# EAGLE schematic Matrix (EAGLE 6.5.0)

## Sheet 1 of 2
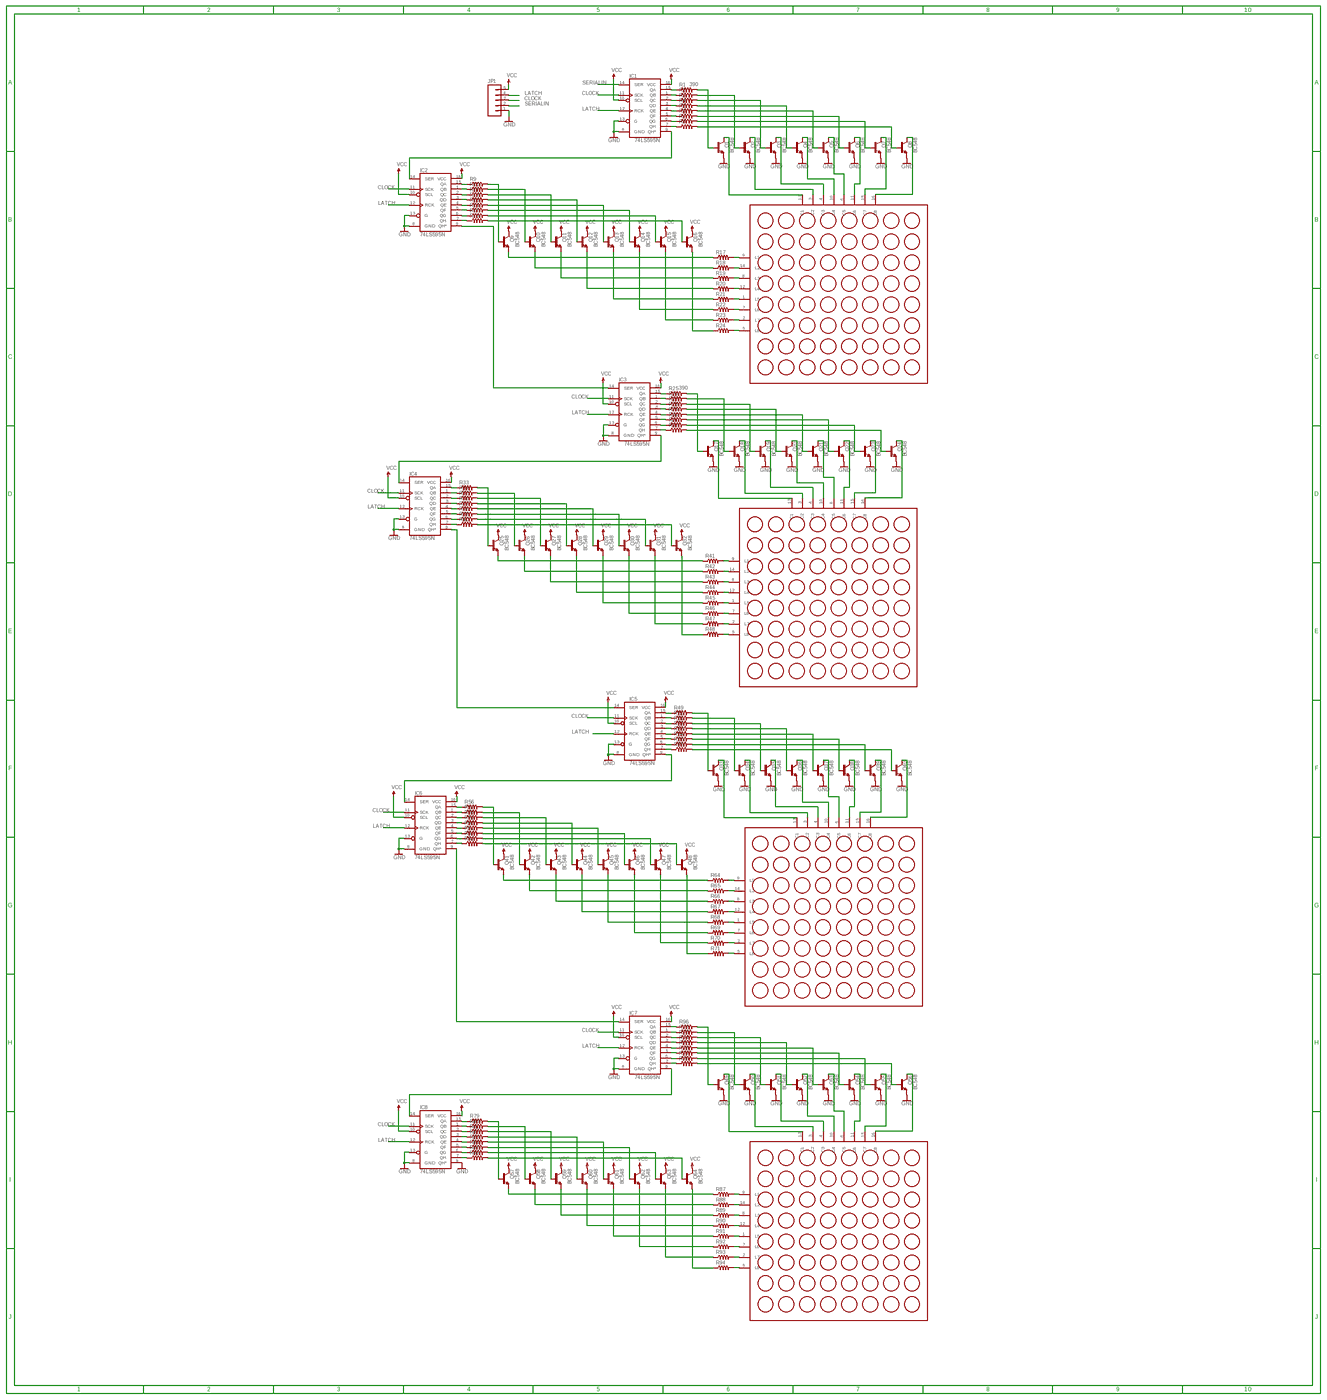
[diagram p0: schematic, sheet 1, overview]
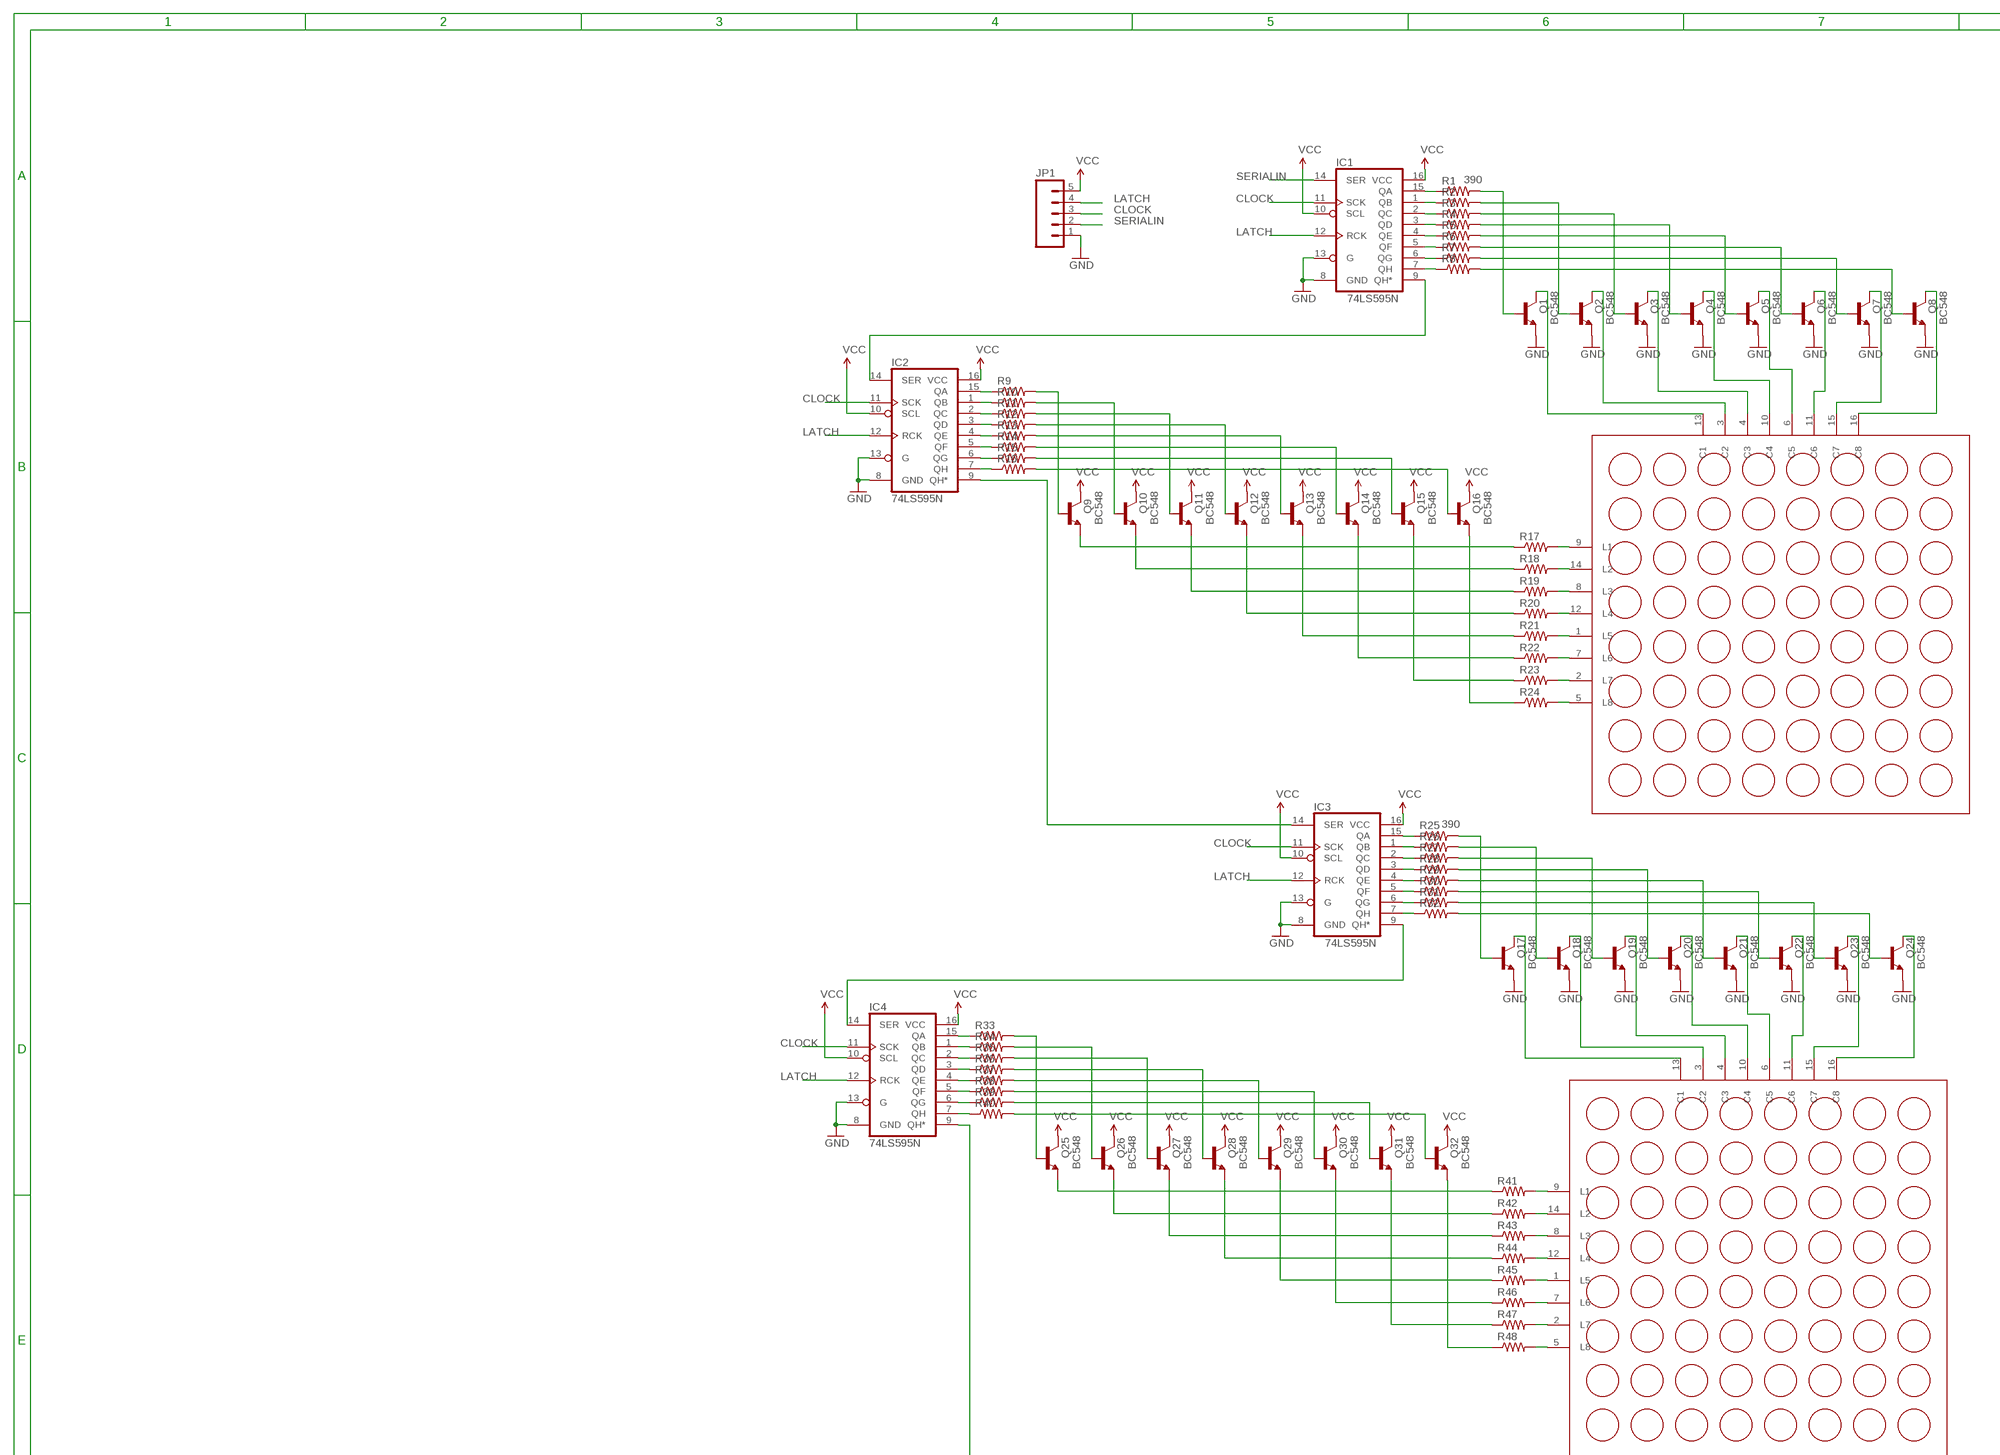
[diagram p1: schematic, sheet 1, part 1 of 4]
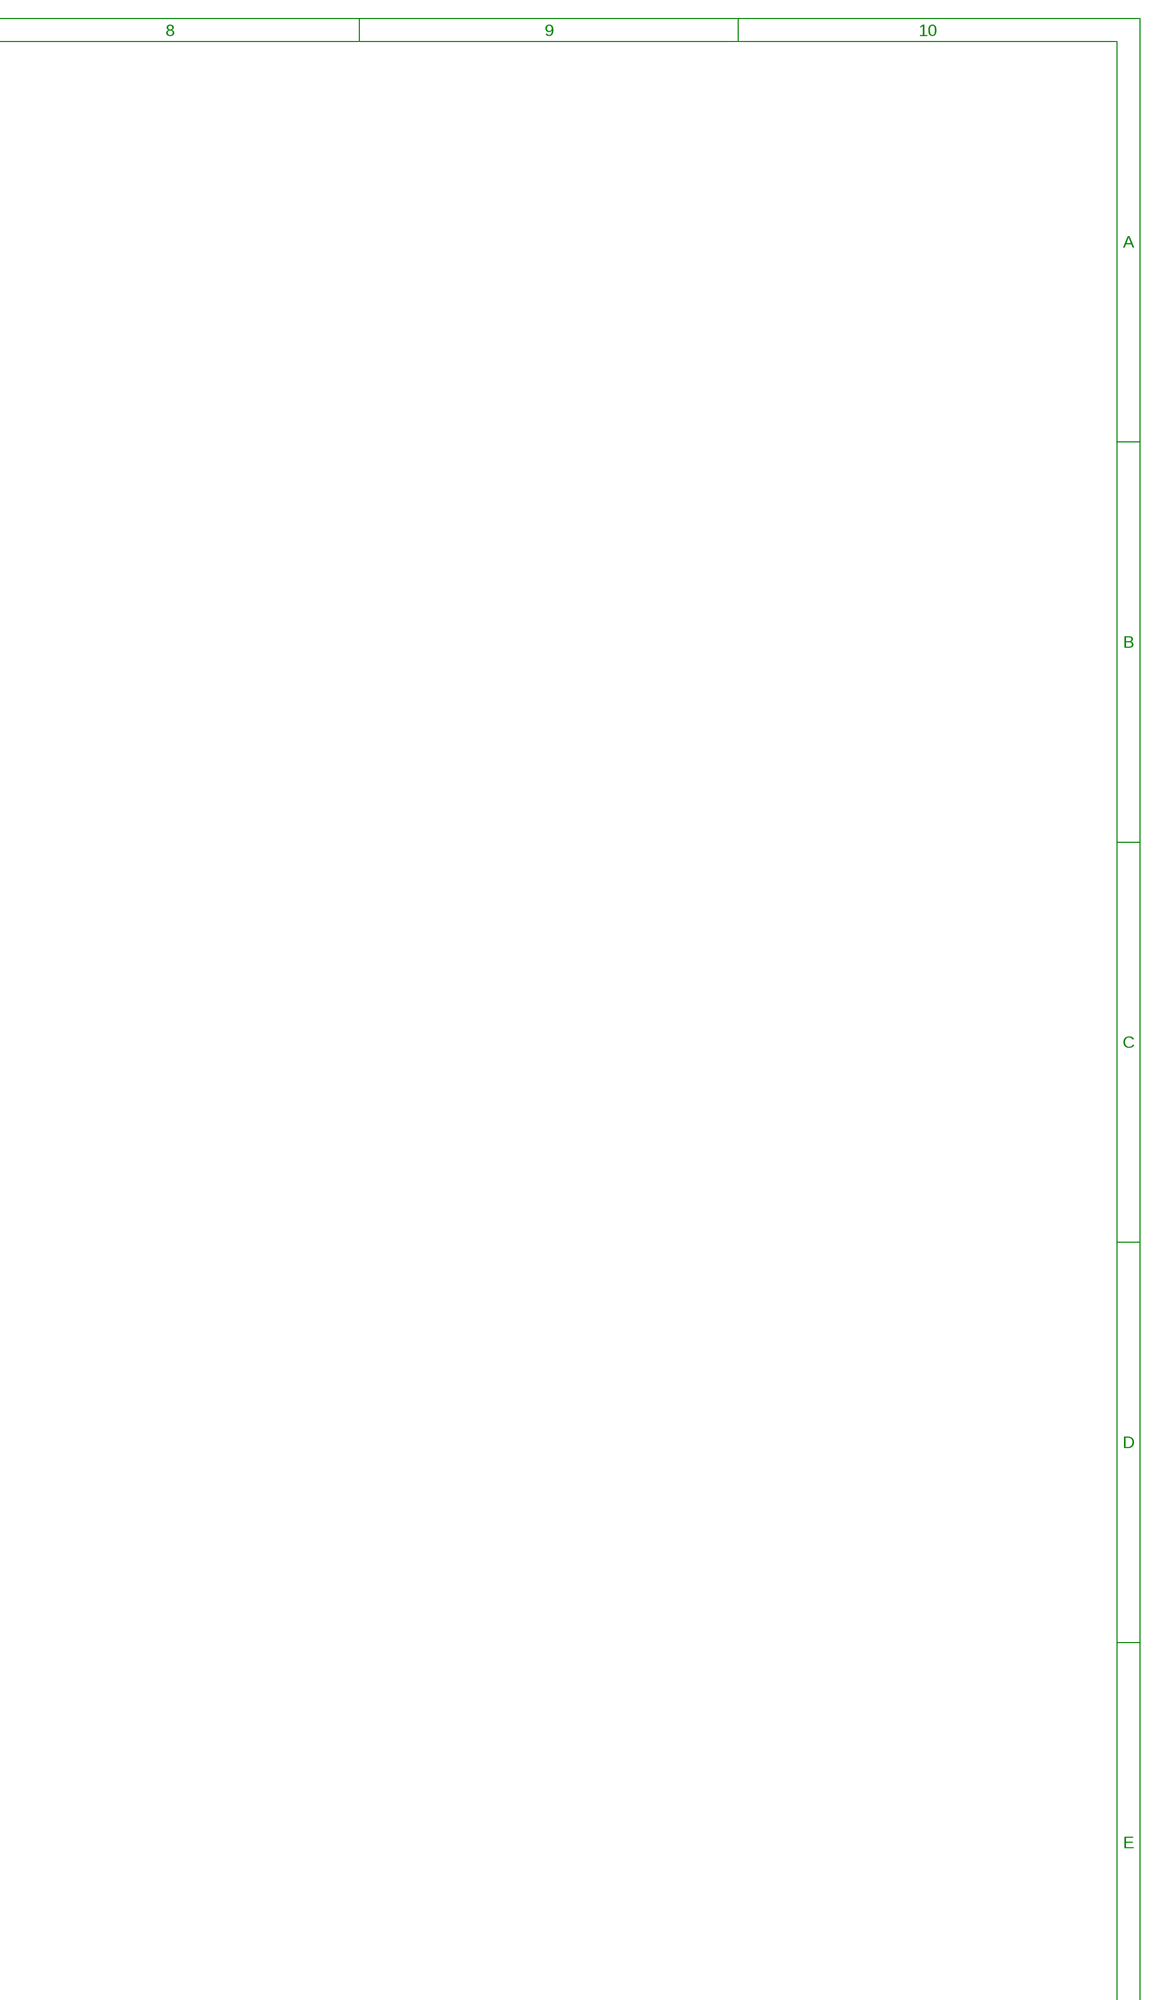
[diagram p2: schematic, sheet 1, part 2 of 4]
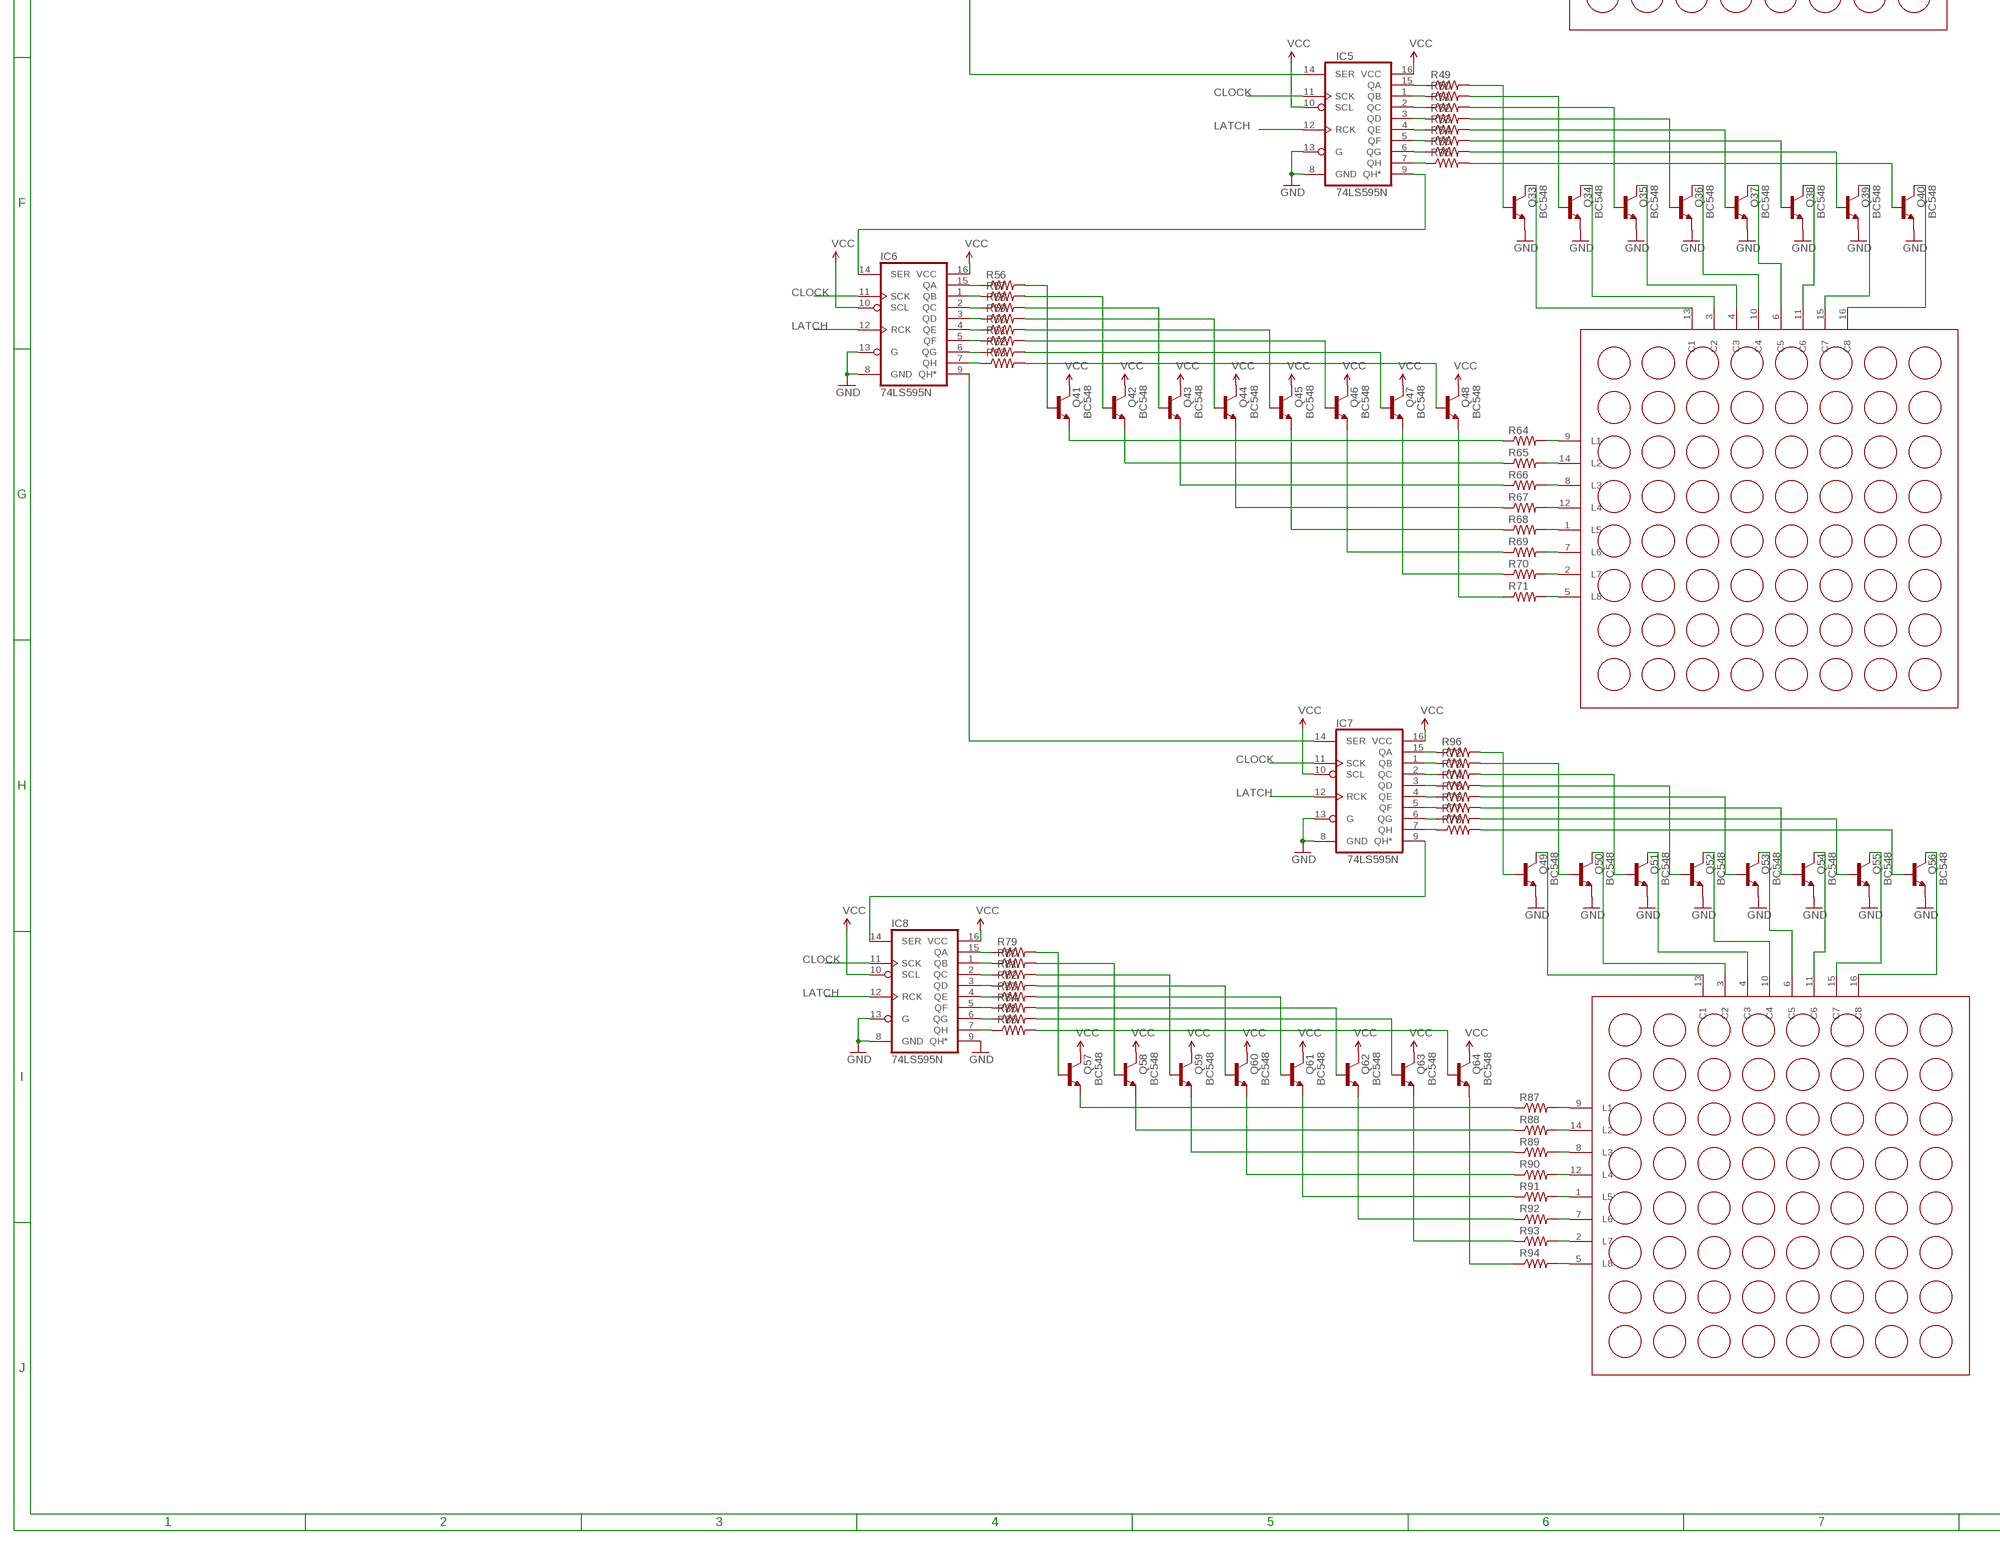
[diagram p3: schematic, sheet 1, part 3 of 4]
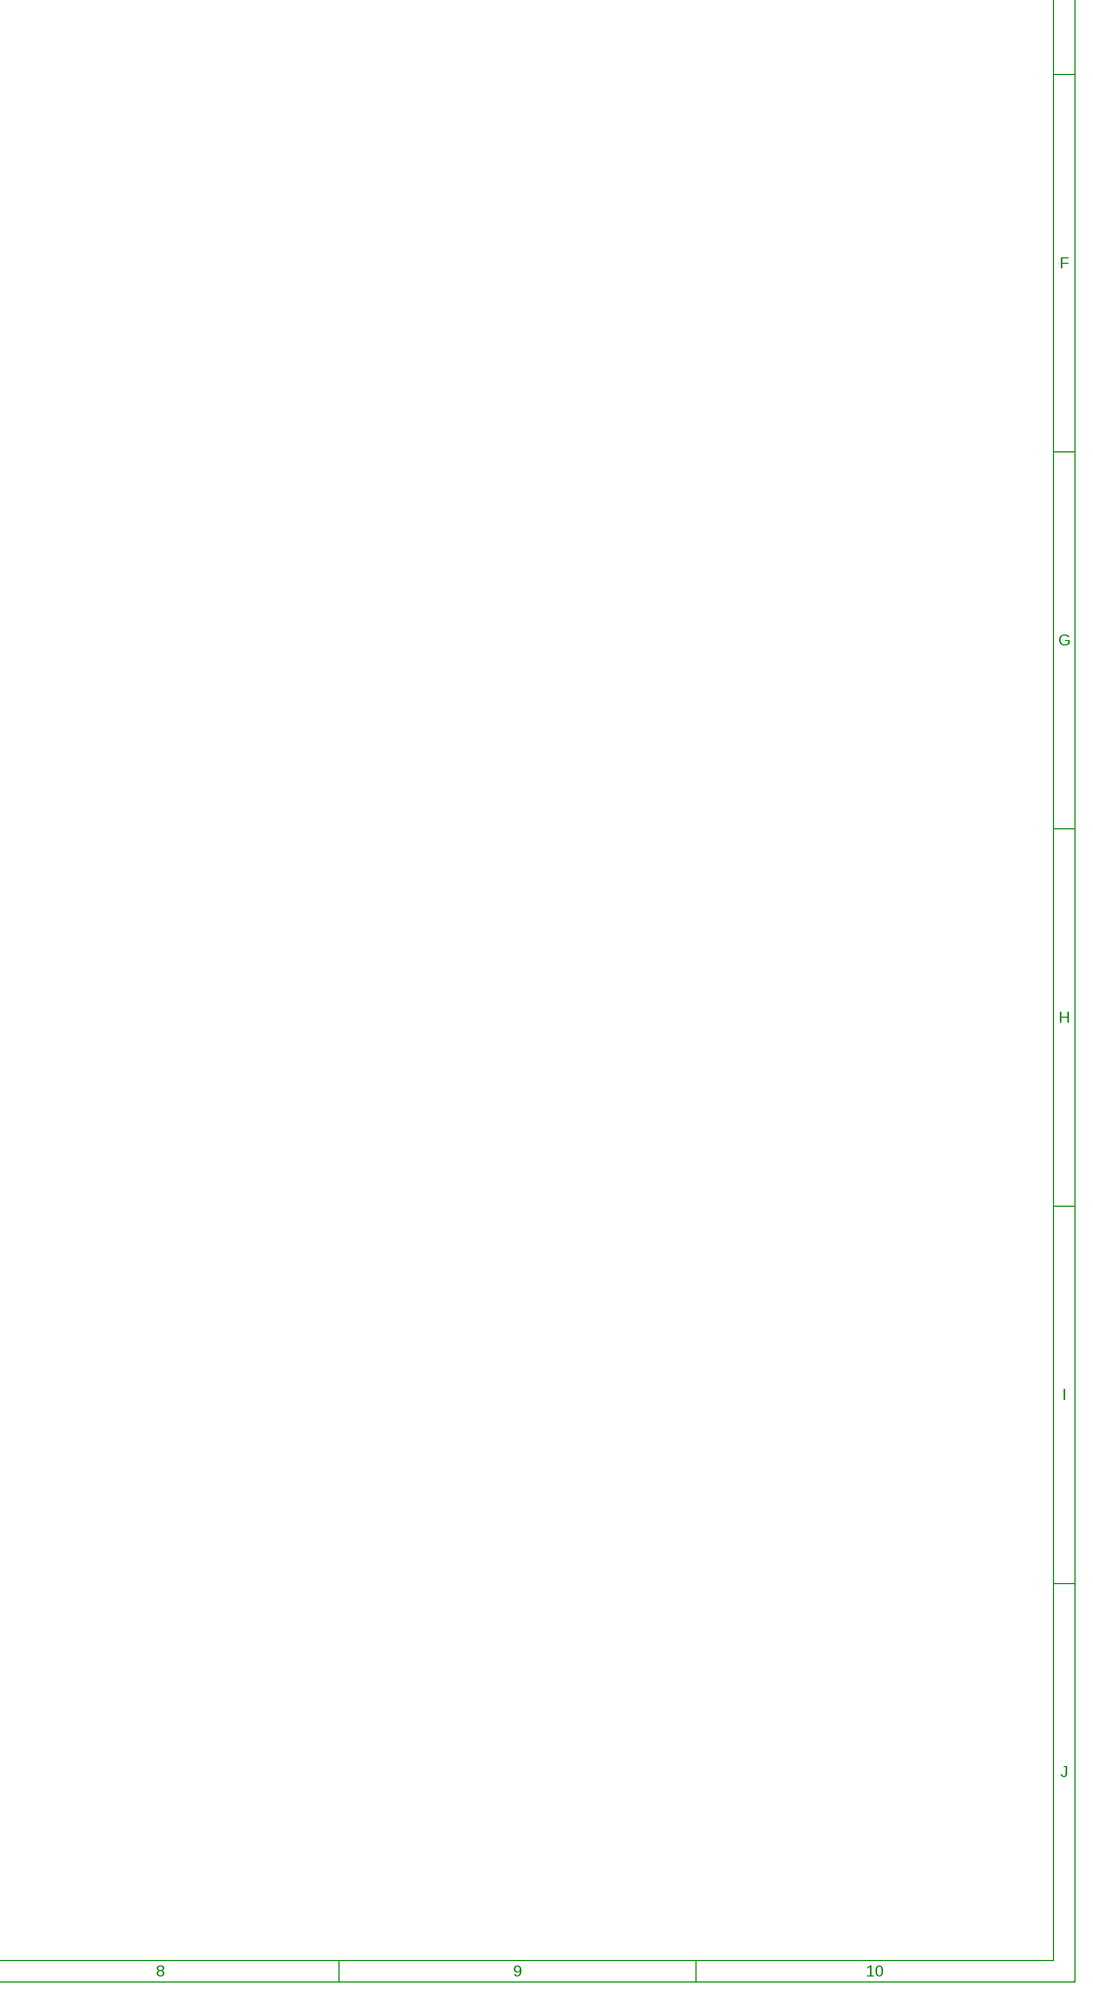
[diagram p4: schematic, sheet 1, part 4 of 4]

### Parts
IC1  74LS595N  [DIL16]
IC2  74LS595N  [DIL16]
IC3  74LS595N  [DIL16]
IC4  74LS595N  [DIL16]
IC5  74LS595N  [DIL16]
IC6  74LS595N  [DIL16]
IC7  74LS595N  [DIL16]
IC8  74LS595N  [DIL16]
JP1  M05PTH_LONGPADS  [1X05_LONGPADS]
Q1  BC548  [TO92-EBC]
Q2  BC548  [TO92-EBC]
Q3  BC548  [TO92-EBC]
Q4  BC548  [TO92-EBC]
Q5  BC548  [TO92-EBC]
Q6  BC548  [TO92-EBC]
Q7  BC548  [TO92-EBC]
Q8  BC548  [TO92-EBC]
Q9  BC548  [TO92-EBC]
Q10  BC548  [TO92-EBC]
Q11  BC548  [TO92-EBC]
Q12  BC548  [TO92-EBC]
Q13  BC548  [TO92-EBC]
Q14  BC548  [TO92-EBC]
Q15  BC548  [TO92-EBC]
Q16  BC548  [TO92-EBC]
Q17  BC548  [TO92-EBC]
Q18  BC548  [TO92-EBC]
Q19  BC548  [TO92-EBC]
Q20  BC548  [TO92-EBC]
Q21  BC548  [TO92-EBC]
Q22  BC548  [TO92-EBC]
Q23  BC548  [TO92-EBC]
Q24  BC548  [TO92-EBC]
Q25  BC548  [TO92-EBC]
Q26  BC548  [TO92-EBC]
Q27  BC548  [TO92-EBC]
Q28  BC548  [TO92-EBC]
Q29  BC548  [TO92-EBC]
Q30  BC548  [TO92-EBC]
Q31  BC548  [TO92-EBC]
Q32  BC548  [TO92-EBC]
Q33  BC548  [TO92-EBC]
Q34  BC548  [TO92-EBC]
Q35  BC548  [TO92-EBC]
Q36  BC548  [TO92-EBC]
Q37  BC548  [TO92-EBC]
Q38  BC548  [TO92-EBC]
Q39  BC548  [TO92-EBC]
Q40  BC548  [TO92-EBC]
Q41  BC548  [TO92-EBC]
Q42  BC548  [TO92-EBC]
Q43  BC548  [TO92-EBC]
Q44  BC548  [TO92-EBC]
Q45  BC548  [TO92-EBC]
Q46  BC548  [TO92-EBC]
Q47  BC548  [TO92-EBC]
Q48  BC548  [TO92-EBC]
Q49  BC548  [TO92-EBC]
Q50  BC548  [TO92-EBC]
Q51  BC548  [TO92-EBC]
Q52  BC548  [TO92-EBC]
Q53  BC548  [TO92-EBC]
Q54  BC548  [TO92-EBC]
Q55  BC548  [TO92-EBC]
Q56  BC548  [TO92-EBC]
Q57  BC548  [TO92-EBC]
Q58  BC548  [TO92-EBC]
Q59  BC548  [TO92-EBC]
Q60  BC548  [TO92-EBC]
Q61  BC548  [TO92-EBC]
Q62  BC548  [TO92-EBC]
Q63  BC548  [TO92-EBC]
Q64  BC548  [TO92-EBC]
R1  390  RESISTORPTH-1/4W  [AXIAL-0.4]
R2  390  RESISTORPTH-1/4W  [AXIAL-0.4]
R3  390  RESISTORPTH-1/4W  [AXIAL-0.4]
R4  390  RESISTORPTH-1/4W  [AXIAL-0.4]
R5  390  RESISTORPTH-1/4W  [AXIAL-0.4]
R6  390  RESISTORPTH-1/4W  [AXIAL-0.4]
R7  390  RESISTORPTH-1/4W  [AXIAL-0.4]
R8  390  RESISTORPTH-1/4W  [AXIAL-0.4]
R9  390  RESISTORPTH-1/4W  [AXIAL-0.4]
R10  390  RESISTORPTH-1/4W  [AXIAL-0.4]
R11  390  RESISTORPTH-1/4W  [AXIAL-0.4]
R12  390  RESISTORPTH-1/4W  [AXIAL-0.4]
R13  390  RESISTORPTH-1/4W  [AXIAL-0.4]
R14  390  RESISTORPTH-1/4W  [AXIAL-0.4]
R15  390  RESISTORPTH-1/4W  [AXIAL-0.4]
R16  390  RESISTORPTH-1/4W  [AXIAL-0.4]
R17  390  RESISTORPTH-1/4W  [AXIAL-0.4]
R18  390  RESISTORPTH-1/4W  [AXIAL-0.4]
R19  390  RESISTORPTH-1/4W  [AXIAL-0.4]
R20  390  RESISTORPTH-1/4W  [AXIAL-0.4]
R21  390  RESISTORPTH-1/4W  [AXIAL-0.4]
R22  390  RESISTORPTH-1/4W  [AXIAL-0.4]
R23  390  RESISTORPTH-1/4W  [AXIAL-0.4]
R24  390  RESISTORPTH-1/4W  [AXIAL-0.4]
R25  390  RESISTORPTH-1/4W  [AXIAL-0.4]
R26  390  RESISTORPTH-1/4W  [AXIAL-0.4]
R27  390  RESISTORPTH-1/4W  [AXIAL-0.4]
R28  390  RESISTORPTH-1/4W  [AXIAL-0.4]
R29  390  RESISTORPTH-1/4W  [AXIAL-0.4]
R30  390  RESISTORPTH-1/4W  [AXIAL-0.4]
R31  390  RESISTORPTH-1/4W  [AXIAL-0.4]
R32  390  RESISTORPTH-1/4W  [AXIAL-0.4]
R33  390  RESISTORPTH-1/4W  [AXIAL-0.4]
R34  390  RESISTORPTH-1/4W  [AXIAL-0.4]
R35  390  RESISTORPTH-1/4W  [AXIAL-0.4]
R36  390  RESISTORPTH-1/4W  [AXIAL-0.4]
R37  390  RESISTORPTH-1/4W  [AXIAL-0.4]
R38  390  RESISTORPTH-1/4W  [AXIAL-0.4]
R39  390  RESISTORPTH-1/4W  [AXIAL-0.4]
R40  390  RESISTORPTH-1/4W  [AXIAL-0.4]
R41  390  RESISTORPTH-1/4W  [AXIAL-0.4]
R42  390  RESISTORPTH-1/4W  [AXIAL-0.4]
R43  390  RESISTORPTH-1/4W  [AXIAL-0.4]
R44  390  RESISTORPTH-1/4W  [AXIAL-0.4]
R45  390  RESISTORPTH-1/4W  [AXIAL-0.4]
R46  390  RESISTORPTH-1/4W  [AXIAL-0.4]
R47  390  RESISTORPTH-1/4W  [AXIAL-0.4]
R48  390  RESISTORPTH-1/4W  [AXIAL-0.4]
R49  390  RESISTORPTH-1/4W  [AXIAL-0.4]
R50  390  RESISTORPTH-1/4W  [AXIAL-0.4]
R51  390  RESISTORPTH-1/4W  [AXIAL-0.4]
R52  390  RESISTORPTH-1/4W  [AXIAL-0.4]
R53  390  RESISTORPTH-1/4W  [AXIAL-0.4]
R54  390  RESISTORPTH-1/4W  [AXIAL-0.4]
R55  390  RESISTORPTH-1/4W  [AXIAL-0.4]
R56  390  RESISTORPTH-1/4W  [AXIAL-0.4]
R57  390  RESISTORPTH-1/4W  [AXIAL-0.4]
R58  390  RESISTORPTH-1/4W  [AXIAL-0.4]
R59  390  RESISTORPTH-1/4W  [AXIAL-0.4]
R60  390  RESISTORPTH-1/4W  [AXIAL-0.4]
R61  390  RESISTORPTH-1/4W  [AXIAL-0.4]
R62  390  RESISTORPTH-1/4W  [AXIAL-0.4]
R63  390  RESISTORPTH-1/4W  [AXIAL-0.4]
R64  390  RESISTORPTH-1/4W  [AXIAL-0.4]
R65  390  RESISTORPTH-1/4W  [AXIAL-0.4]
R66  390  RESISTORPTH-1/4W  [AXIAL-0.4]
R67  390  RESISTORPTH-1/4W  [AXIAL-0.4]
R68  390  RESISTORPTH-1/4W  [AXIAL-0.4]
R69  390  RESISTORPTH-1/4W  [AXIAL-0.4]
R70  390  RESISTORPTH-1/4W  [AXIAL-0.4]
R71  390  RESISTORPTH-1/4W  [AXIAL-0.4]
R72  390  RESISTORPTH-1/4W  [AXIAL-0.4]
R73  390  RESISTORPTH-1/4W  [AXIAL-0.4]
R74  390  RESISTORPTH-1/4W  [AXIAL-0.4]
R75  390  RESISTORPTH-1/4W  [AXIAL-0.4]
R76  390  RESISTORPTH-1/4W  [AXIAL-0.4]
R77  390  RESISTORPTH-1/4W  [AXIAL-0.4]
R78  390  RESISTORPTH-1/4W  [AXIAL-0.4]
R79  390  RESISTORPTH-1/4W  [AXIAL-0.4]
R80  390  RESISTORPTH-1/4W  [AXIAL-0.4]
R81  390  RESISTORPTH-1/4W  [AXIAL-0.4]
R82  390  RESISTORPTH-1/4W  [AXIAL-0.4]
R83  390  RESISTORPTH-1/4W  [AXIAL-0.4]
R84  390  RESISTORPTH-1/4W  [AXIAL-0.4]
R85  390  RESISTORPTH-1/4W  [AXIAL-0.4]
R86  390  RESISTORPTH-1/4W  [AXIAL-0.4]
R87  390  RESISTORPTH-1/4W  [AXIAL-0.4]
R88  390  RESISTORPTH-1/4W  [AXIAL-0.4]
R89  390  RESISTORPTH-1/4W  [AXIAL-0.4]
R90  390  RESISTORPTH-1/4W  [AXIAL-0.4]
R91  390  RESISTORPTH-1/4W  [AXIAL-0.4]
R92  390  RESISTORPTH-1/4W  [AXIAL-0.4]
R93  390  RESISTORPTH-1/4W  [AXIAL-0.4]
R94  390  RESISTORPTH-1/4W  [AXIAL-0.4]
R95  390  RESISTORPTH-1/4W  [AXIAL-0.4]
R96  390  RESISTORPTH-1/4W  [AXIAL-0.4]
U$1  LEDMATRIX(HS2388)  [HS2388]
U$2  LEDMATRIX(HS2388)  [HS2388]
U$3  LEDMATRIX(HS2388)  [HS2388]
U$4  LEDMATRIX(HS2388)  [HS2388]

### Nets
CLOCK: IC1.11(SCK) IC2.11(SCK) IC3.11(SCK) IC4.11(SCK) IC5.11(SCK) IC6.11(SCK) IC7.11(SCK) IC8.11(SCK) JP1.3
GND: IC1.8(GND) IC1.13(G) IC2.8(GND) IC2.13(G) IC3.8(GND) IC3.13(G) IC4.8(GND) IC4.13(G) IC5.8(GND) IC5.13(G) IC6.8(GND) IC6.13(G) IC7.8(GND) IC7.13(G) IC8.8(GND) IC8.9(QH*) IC8.13(G) JP1.1 Q1.E Q2.E Q3.E Q4.E Q5.E Q6.E Q7.E Q8.E Q17.E Q18.E Q19.E Q20.E Q21.E Q22.E Q23.E Q24.E Q33.E Q34.E Q35.E Q36.E Q37.E Q38.E Q39.E Q40.E Q49.E Q50.E Q51.E Q52.E Q53.E Q54.E Q55.E Q56.E
LATCH: IC1.12(RCK) IC2.12(RCK) IC3.12(RCK) IC4.12(RCK) IC5.12(RCK) IC6.12(RCK) IC7.12(RCK) IC8.12(RCK) JP1.4
N$1: Q1.B R1.P$2
N$2: IC1.15(QA) R1.P$1
N$3: Q8.B R8.P$2
N$4: IC1.1(QB) R2.P$1
N$5: Q16.E R24.P$1
N$6: Q15.E R23.P$1
N$7: Q14.E R22.P$1
N$8: IC1.2(QC) R3.P$1
N$9: IC1.3(QD) R4.P$1
N$10: IC1.4(QE) R5.P$1
N$11: IC1.5(QF) R6.P$1
N$12: IC1.6(QG) R7.P$1
N$13: IC1.7(QH) R8.P$1
N$14: Q13.E R21.P$1
N$15: Q2.B R2.P$2
N$16: Q4.B R4.P$2
N$17: Q5.B R5.P$2
N$18: Q6.B R6.P$2
N$19: Q7.B R7.P$2
N$20: Q1.C U$1.13(C1)
N$21: Q2.C U$1.3(C2)
N$22: Q3.B R3.P$2
N$23: Q24.B R32.P$2
N$24: Q4.C U$1.10(C4)
N$25: Q5.C U$1.6(C5)
N$26: Q6.C U$1.11(C6)
N$27: Q7.C U$1.15(C7)
N$28: Q8.C U$1.16(C8)
N$29: Q12.E R20.P$1
N$30: Q11.E R19.P$1
N$31: Q10.E R18.P$1
N$32: Q9.E R17.P$1
N$33: R17.P$2 U$1.9(L1)
N$34: R18.P$2 U$1.14(L2)
N$35: R19.P$2 U$1.8(L3)
N$36: R20.P$2 U$1.12(L4)
N$37: R21.P$2 U$1.1(L5)
N$38: R22.P$2 U$1.7(L6)
N$39: R23.P$2 U$1.2(L7)
N$40: R24.P$2 U$1.5(L8)
N$41: Q9.B R9.P$2
N$42: Q10.B R10.P$2
N$43: Q11.B R11.P$2
N$44: Q12.B R12.P$2
N$45: Q13.B R13.P$2
N$46: Q14.B R14.P$2
N$47: Q15.B R15.P$2
N$48: Q16.B R16.P$2
N$49: IC2.15(QA) R9.P$1
N$50: IC2.1(QB) R10.P$1
N$51: IC2.2(QC) R11.P$1
N$52: IC2.3(QD) R12.P$1
N$53: IC2.4(QE) R13.P$1
N$54: IC2.5(QF) R14.P$1
N$55: IC2.6(QG) R15.P$1
N$56: IC2.7(QH) R16.P$1
N$57: IC1.9(QH*) IC2.14(SER)
N$58: Q19.B R27.P$2
N$59: Q3.C U$1.4(C3)
N$60: Q17.B R25.P$2
N$61: Q18.B R26.P$2
N$62: Q20.B R28.P$2
N$63: Q21.B R29.P$2
N$64: Q22.B R30.P$2
N$65: Q23.B R31.P$2
N$66: Q17.C U$2.13(C1)
N$67: Q18.C U$2.3(C2)
N$68: Q20.C U$2.10(C4)
N$69: Q21.C U$2.6(C5)
N$70: Q22.C U$2.11(C6)
N$71: Q23.C U$2.15(C7)
N$72: Q24.C U$2.16(C8)
N$73: IC3.15(QA) R25.P$1
N$74: IC3.1(QB) R26.P$1
N$75: IC3.2(QC) R27.P$1
N$76: IC3.3(QD) R28.P$1
N$77: IC3.4(QE) R29.P$1
N$78: IC3.5(QF) R30.P$1
N$79: IC3.6(QG) R31.P$1
N$80: IC3.7(QH) R32.P$1
N$81: Q32.E R48.P$1
N$82: Q31.E R47.P$1
N$83: Q30.E R46.P$1
N$84: Q29.E R45.P$1
N$85: Q28.E R44.P$1
N$86: Q27.E R43.P$1
N$87: Q26.E R42.P$1
N$88: Q25.E R41.P$1
N$89: R41.P$2 U$2.9(L1)
N$90: R42.P$2 U$2.14(L2)
N$91: R43.P$2 U$2.8(L3)
N$92: R44.P$2 U$2.12(L4)
N$93: R45.P$2 U$2.1(L5)
N$94: R46.P$2 U$2.7(L6)
N$95: R47.P$2 U$2.2(L7)
N$96: R48.P$2 U$2.5(L8)
N$97: Q25.B R33.P$2
N$98: Q26.B R34.P$2
N$99: Q27.B R35.P$2
N$100: Q28.B R36.P$2
N$101: Q29.B R37.P$2
N$102: Q30.B R38.P$2
N$103: Q31.B R39.P$2
N$104: Q32.B R40.P$2
N$105: IC4.15(QA) R33.P$1
N$106: IC4.1(QB) R34.P$1
N$107: IC4.2(QC) R35.P$1
N$108: IC4.3(QD) R36.P$1
N$109: IC4.4(QE) R37.P$1
N$110: IC4.5(QF) R38.P$1
N$111: IC4.6(QG) R39.P$1
N$112: IC4.7(QH) R40.P$1
N$113: Q19.C U$2.4(C3)
N$114: IC3.9(QH*) IC4.14(SER)
N$115: Q40.B R95.P$2
N$116: Q35.B R51.P$2
N$117: IC2.9(QH*) IC3.14(SER)
N$118: Q34.B R50.P$2
N$119: Q36.B R52.P$2
N$120: Q37.B R53.P$2
N$121: Q38.B R54.P$2
N$122: Q39.B R55.P$2
N$123: Q33.C U$3.13(C1)
N$124: Q34.C U$3.3(C2)
N$125: Q36.C U$3.10(C4)
N$126: Q37.C U$3.6(C5)
N$127: Q38.C U$3.11(C6)
N$128: Q39.C U$3.15(C7)
N$129: Q40.C U$3.16(C8)
N$130: Q33.B R49.P$2
N$131: IC6.9(QH*) IC7.14(SER)
N$132: IC5.7(QH) R95.P$1
N$133: IC5.6(QG) R55.P$1
N$134: IC5.5(QF) R54.P$1
N$135: IC5.4(QE) R53.P$1
N$136: IC5.3(QD) R52.P$1
N$137: Q48.E R71.P$1
N$138: Q47.E R70.P$1
N$139: Q46.E R69.P$1
N$140: Q45.E R68.P$1
N$141: Q44.E R67.P$1
N$142: Q43.E R66.P$1
N$143: Q42.E R65.P$1
N$144: Q41.E R64.P$1
N$145: R64.P$2 U$3.9(L1)
N$146: R65.P$2 U$3.14(L2)
N$147: R66.P$2 U$3.8(L3)
N$148: R67.P$2 U$3.12(L4)
N$149: R68.P$2 U$3.1(L5)
N$150: R69.P$2 U$3.7(L6)
N$151: R70.P$2 U$3.2(L7)
N$152: R71.P$2 U$3.5(L8)
N$153: Q41.B R56.P$2
N$154: Q42.B R57.P$2
N$155: Q43.B R58.P$2
N$156: Q44.B R59.P$2
N$157: Q45.B R60.P$2
N$158: Q46.B R61.P$2
N$159: Q47.B R62.P$2
N$160: Q48.B R63.P$2
N$161: IC6.15(QA) R56.P$1
N$162: IC6.1(QB) R57.P$1
N$163: IC6.2(QC) R58.P$1
N$164: IC6.3(QD) R59.P$1
N$165: IC6.4(QE) R60.P$1
N$166: IC6.5(QF) R61.P$1
N$167: IC6.6(QG) R62.P$1
N$168: IC6.7(QH) R63.P$1
N$169: Q35.C U$3.4(C3)
N$170: IC5.9(QH*) IC6.14(SER)
N$171: Q56.B R78.P$2
N$172: Q51.B R73.P$2
N$173: Q49.B R96.P$2
N$174: Q50.B R72.P$2
N$175: Q52.B R74.P$2
N$176: Q53.B R75.P$2
N$177: Q54.B R76.P$2
N$178: Q55.B R77.P$2
N$179: Q49.C U$4.13(C1)
N$180: Q50.C U$4.3(C2)
N$181: Q52.C U$4.10(C4)
N$182: Q53.C U$4.6(C5)
N$183: Q54.C U$4.11(C6)
N$184: Q55.C U$4.15(C7)
N$185: Q56.C U$4.16(C8)
N$186: IC7.1(QB) R72.P$1
N$187: IC7.2(QC) R73.P$1
N$188: IC7.3(QD) R74.P$1
N$189: IC7.4(QE) R75.P$1
N$190: IC7.5(QF) R76.P$1
N$191: IC7.6(QG) R77.P$1
N$192: IC7.7(QH) R78.P$1
N$193: Q64.E R94.P$1
N$194: Q63.E R93.P$1
N$195: Q62.E R92.P$1
N$196: Q61.E R91.P$1
N$197: Q60.E R90.P$1
N$198: Q59.E R89.P$1
N$199: Q58.E R88.P$1
N$200: Q57.E R87.P$1
N$201: R87.P$2 U$4.9(L1)
N$202: R88.P$2 U$4.14(L2)
N$203: R89.P$2 U$4.8(L3)
N$204: R90.P$2 U$4.12(L4)
N$205: R91.P$2 U$4.1(L5)
N$206: R92.P$2 U$4.7(L6)
N$207: R93.P$2 U$4.2(L7)
N$208: R94.P$2 U$4.5(L8)
N$209: Q57.B R79.P$2
N$210: Q58.B R80.P$2
N$211: Q59.B R81.P$2
N$212: Q60.B R82.P$2
N$213: Q61.B R83.P$2
N$214: Q62.B R84.P$2
N$215: Q63.B R85.P$2
N$216: Q64.B R86.P$2
N$217: IC8.15(QA) R79.P$1
N$218: IC8.1(QB) R80.P$1
N$219: IC8.2(QC) R81.P$1
N$220: IC8.3(QD) R82.P$1
N$221: IC8.4(QE) R83.P$1
N$222: IC8.5(QF) R84.P$1
N$223: IC8.6(QG) R85.P$1
N$224: IC8.7(QH) R86.P$1
N$225: Q51.C U$4.4(C3)
N$226: IC7.9(QH*) IC8.14(SER)
N$227: IC4.9(QH*) IC5.14(SER)
N$228: IC5.2(QC) R51.P$1
N$229: IC5.1(QB) R50.P$1
N$230: IC5.15(QA) R49.P$1
N$231: IC7.15(QA) R96.P$1
SERIALIN: IC1.14(SER) JP1.2
VCC: IC1.10(SCL) IC1.16(VCC) IC2.10(SCL) IC2.16(VCC) IC3.10(SCL) IC3.16(VCC) IC4.10(SCL) IC4.16(VCC) IC5.10(SCL) IC5.16(VCC) IC6.10(SCL) IC6.16(VCC) IC7.10(SCL) IC7.16(VCC) IC8.10(SCL) IC8.16(VCC) JP1.5 Q9.C Q10.C Q11.C Q12.C Q13.C Q14.C Q15.C Q16.C Q25.C Q26.C Q27.C Q28.C Q29.C Q30.C Q31.C Q32.C Q41.C Q42.C Q43.C Q44.C Q45.C Q46.C Q47.C Q48.C Q57.C Q58.C Q59.C Q60.C Q61.C Q62.C Q63.C Q64.C

## Sheet 2 of 2
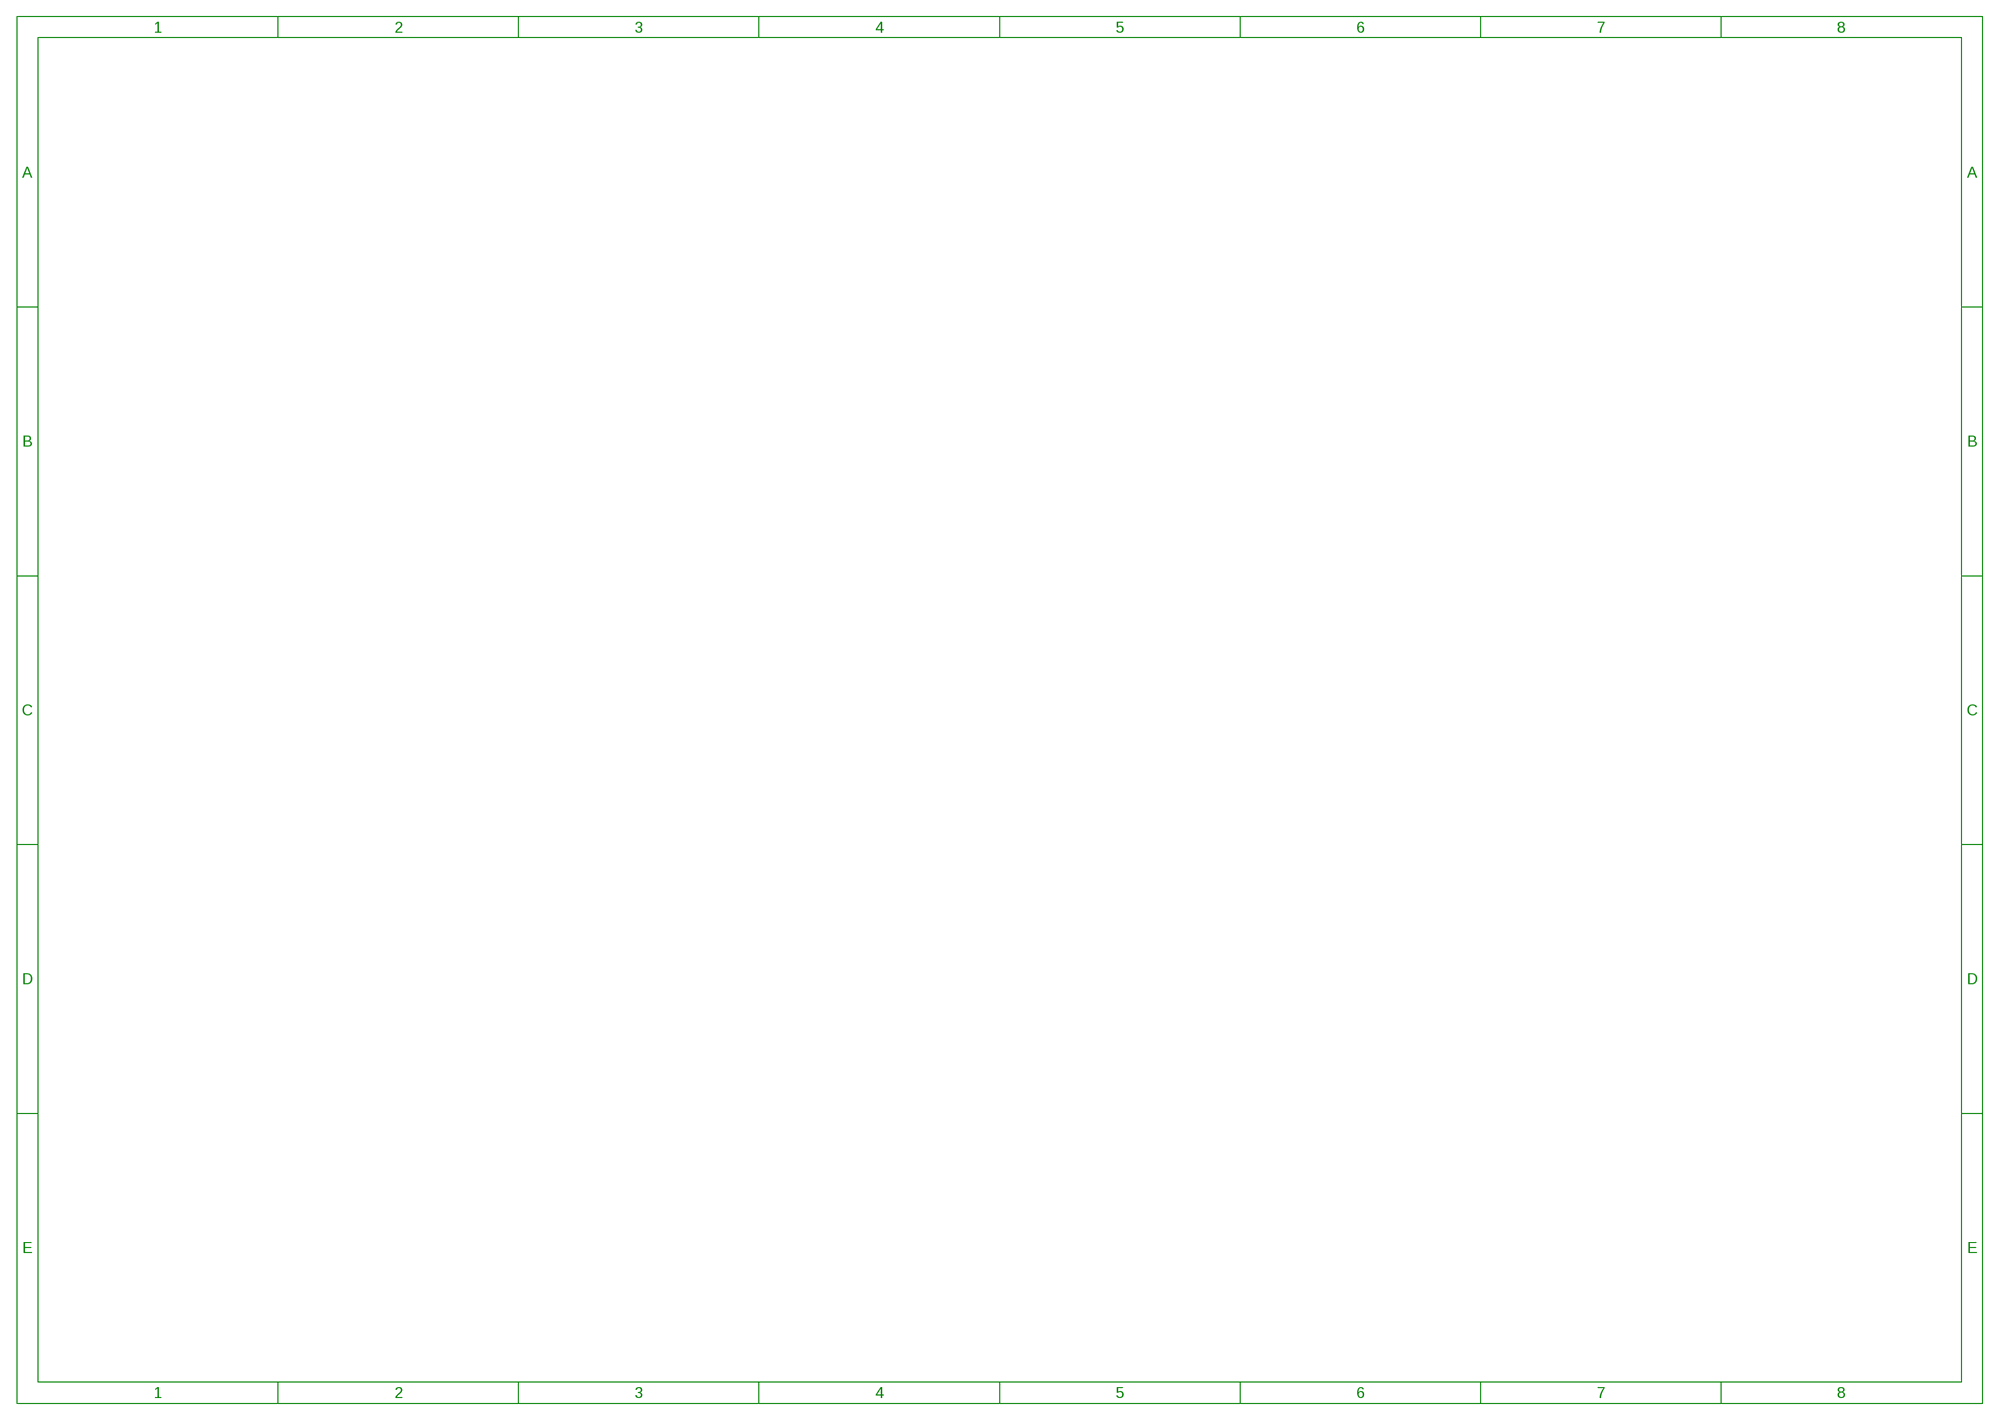
[diagram p5: schematic, sheet 2]

## Library data of the parts
IC1-IC8 = SparkFun:74*595: 8-bit SHIFT REGISTER, output latch
JP1 = SparkFun:M05: Header 5 Standard 5-pin 0.1" header. Use with straight break away headers (SKU : PRT-00116), right angle break away headers (PRT-00553), swiss pins (PRT-00743), machine pins (PRT-00117), and female headers (PRT-00115). Molex polarized connector foot print use with SKU : PRT-08230 with associated crimp pins and housings.
Q1-Q64 = transistor-npn:BC548*: NPN Transistor
R1-R96 = SparkFun:RESISTOR: Resistor Basic schematic elements and footprints for 0603, 1206, and PTH resistors.
U$1-U$4 = HS2388:LEDMATRIX(HS2388)